# EAGLE design mini_board0 (EAGLE 6.4)
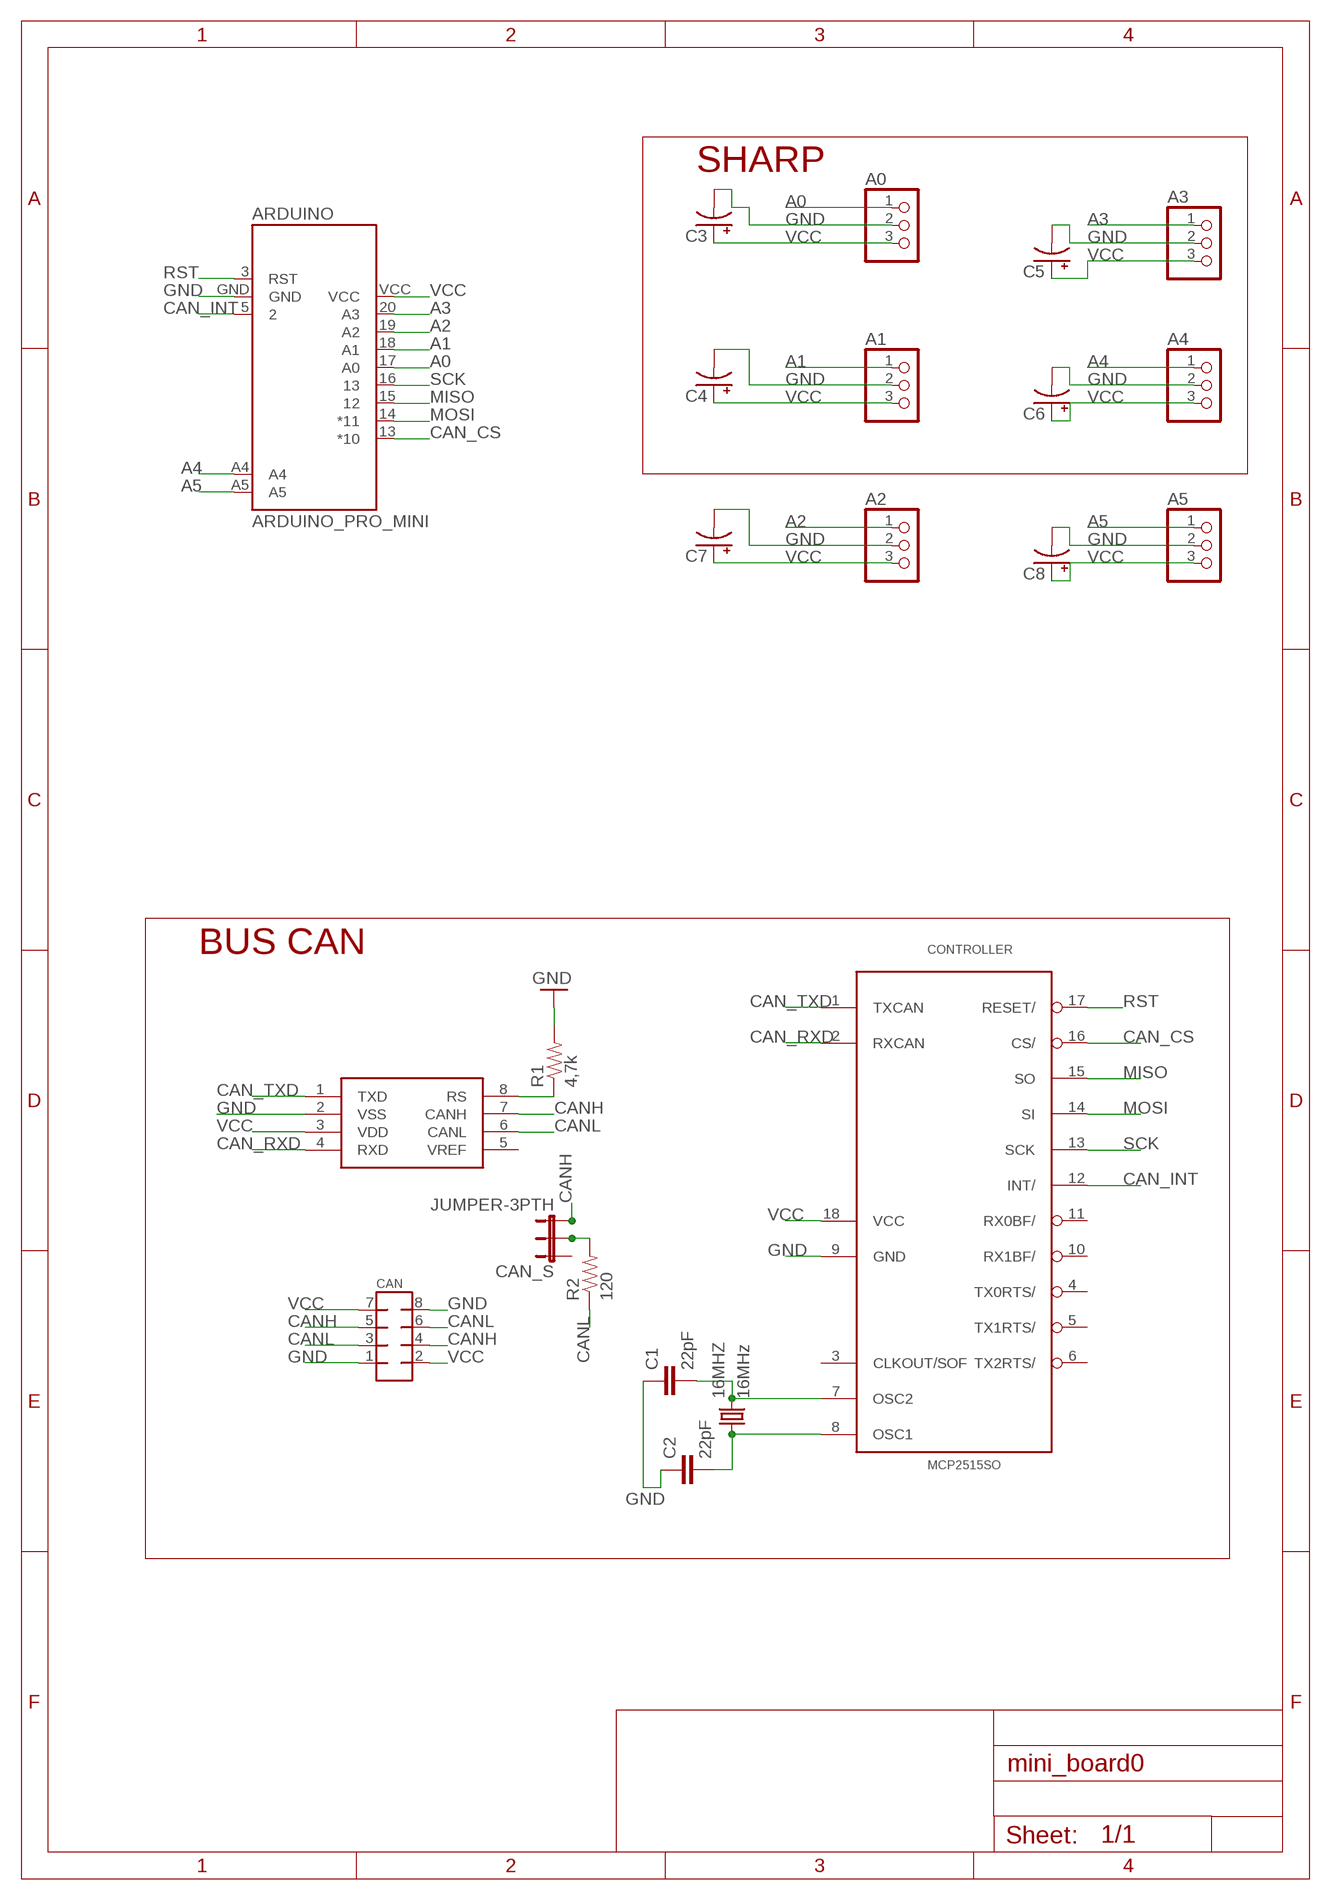
[diagram p0: schematic, sheet 1]

## Parts
16MHZ  16MHz  CRYSTALHC49S  [HC49/S]
A0  PINHD-1X3/90  [1X03/90]
A1  PINHD-1X3/90  [1X03/90]
A2  PINHD-1X3/90  [1X03/90]
A3  PINHD-1X3/90  [1X03/90]
A4  PINHD-1X3/90  [1X03/90]
A5  PINHD-1X3/90  [1X03/90]
ARDUINO  ARDUINO_PRO_MINI  [ARDUINO_PRO_MINI]
C1  22pF  CAP0805  [0805]
C2  22pF  CAP0805  [0805]
C3  CAP_POLPTH2  [CPOL-RADIAL-10UF-25V]
C4  CAP_POLPTH2  [CPOL-RADIAL-10UF-25V]
C5  CAP_POLPTH2  [CPOL-RADIAL-10UF-25V]
C6  CAP_POLPTH2  [CPOL-RADIAL-10UF-25V]
C7  CAP_POLPTH2  [CPOL-RADIAL-10UF-25V]
C8  CAP_POLPTH2  [CPOL-RADIAL-10UF-25V]
CAN  MMATCH-8-PTH  [AMP-215079-8]
CAN_S  JUMPER-3PTH  [1X03]
CONTROLLER  MCP2515SO  [SO18L]
R1  4,7k  RESISTOR0805-RES  [0805]
R2  120  RESISTOR0805-RES  [0805]
U1  MCP2551  [SO08]

## Nets
A0: A0.1 ARDUINO.17(A0)
A1: A1.1 ARDUINO.18(A1)
A2: A2.1 ARDUINO.19(A2)
A3: A3.1 ARDUINO.20(A3)
A4: A4.1 ARDUINO.A4
A5: A5.1 ARDUINO.A5
CAN_CS: ARDUINO.13(*10) CONTROLLER.16(CS/)
CAN_INT: ARDUINO.5 CONTROLLER.12(INT/)
CAN_RXD: CONTROLLER.2(RXCAN) U1.4(RXD)
CAN_TXD: CONTROLLER.1(TXCAN) U1.1(TXD)
CANH: CAN.4 CAN.5 CAN_S.3 U1.7(CANH)
CANL: CAN.3 CAN.6 R2.1 U1.6(CANL)
GND: A0.2 A1.2 A2.2 A3.2 A4.2 A5.2 ARDUINO.GND C1.1 C2.1 C3.2(-) C4.2(-) C5.2(-) C6.2(-) C7.2(-) C8.2(-) CAN.1 CAN.8 CONTROLLER.9(GND) R1.2 U1.2(VSS)
MISO: ARDUINO.15 CONTROLLER.15(SO)
MOSI: ARDUINO.14(*11) CONTROLLER.14(SI)
N$2: 16MHZ.2 C1.2 CONTROLLER.7(OSC2)
N$3: 16MHZ.1 C2.2 CONTROLLER.8(OSC1)
N$5: R1.1 U1.8(RS)
N$7: CAN_S.2 R2.2
RST: ARDUINO.3(RST) CONTROLLER.17(RESET/)
SCK: ARDUINO.16 CONTROLLER.13(SCK)
VCC: A0.3 A1.3 A2.3 A3.3 A4.3 A5.3 ARDUINO.VCC C3.1(+) C4.1(+) C5.1(+) C6.1(+) C7.1(+) C8.1(+) CAN.2 CAN.7 CONTROLLER.18(VCC) U1.3(VDD)
Unconnected: CAN_S.1 CONTROLLER.3(CLKOUT/SOF) CONTROLLER.4(TX0RTS/) CONTROLLER.5(TX1RTS/) CONTROLLER.6(TX2RTS/) CONTROLLER.10(RX1BF/) CONTROLLER.11(RX0BF/) U1.5(VREF)

## Notes on the sheet
- SHARP
- BUS CAN

## Library data of the parts
16MHZ = adafruit:CRYSTAL: CRYSTAL; OC_FARNELL: 1667008; OC_NEWARK: unknown
A0 A1-A5 = pinhead:PINHD-1X3: PIN HEADER
ARDUINO = sharp_shield:ARDUINO_PRO_MINI
C1 C2 = SparkFun-Capacitors:CAP: Capacitor Standard 0603 ceramic capacitor, and 0.1" leaded capacitor.
C3-C8 = SparkFun-Capacitors:CAP_POL: Capacitor Polarized These are standard SMD and PTH capacitors. Normally 10uF, 47uF, and 100uF in electrolytic and tantalum varieties. Always verify the external diameter of the through hole cap, it varies with capacity, voltage, and manufacturer. The EIA devices should be standard.
CAN = jt-con-micromatch:MMATCH-8-*: AMP Micromatch 8-pin
CAN_S = SparkFun-Passives:JUMPER-3
CONTROLLER = MCP2515_MT:MCP2515*: MCP2515 Standalone CAN-Controller by Microchip Eagle-Lib. by MartinThomas
R1 R2 = SparkFun-Passives:RESISTOR: Resistor Basic schematic elements and footprints for 0603, 1206, and PTH resistors.
U1 = SparkFun-DigitalIC:MCP2551: CAN transceiver

## Net classes
0 default: clearance 0.205 mm

## Board
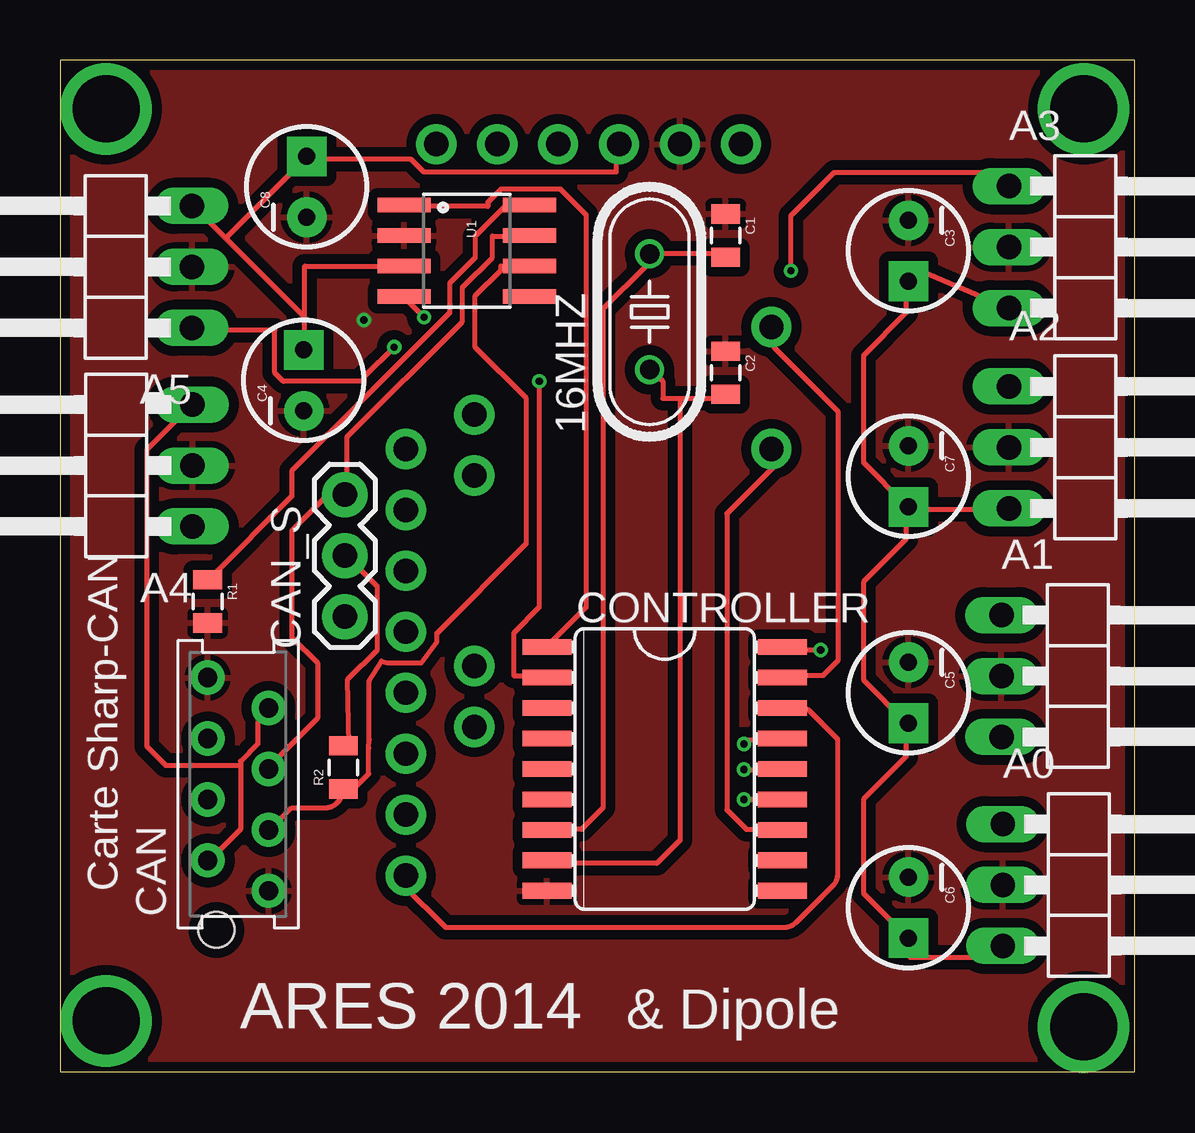
[diagram p1: board, top side]
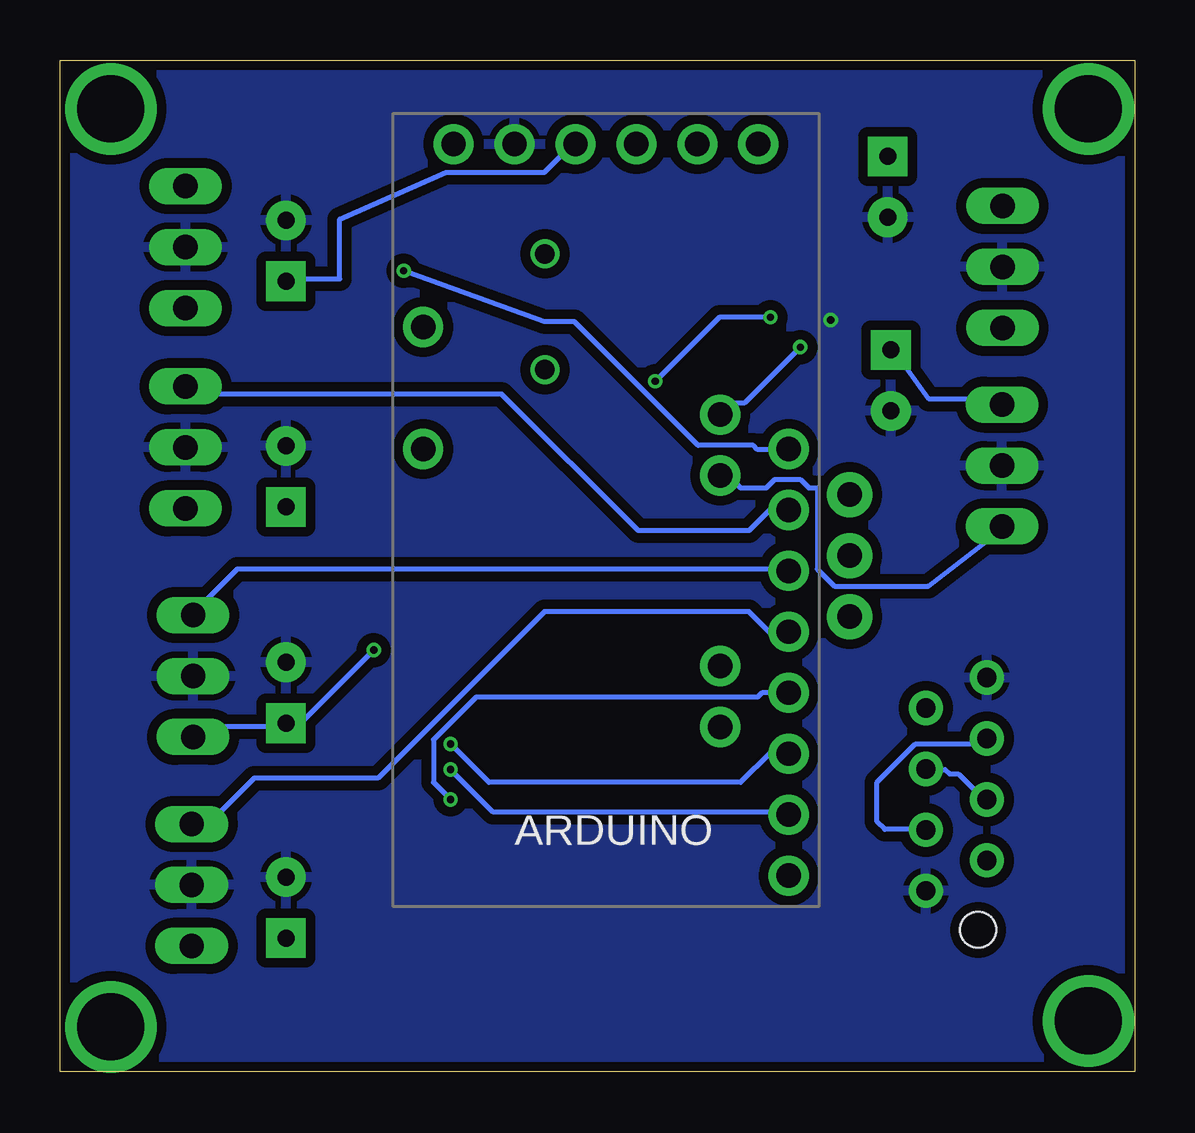
[diagram p2: board, bottom side, seen from below]

Size 44.79 x 42.15 mm. Coordinates in mm from the lower left corner, seen from the top.
Outline: 0,42.15 0,0 44.79,0 44.79,42.15 0,42.15
Copper layers (1*16): Top 0.035mm / dielectric 1.6mm / Bottom 0.035mm
Design rules "dipole *": minimum track width 0.2mm, minimum drill 0.3mm, track to track 0.15mm, track to pad 0.15mm, pad to pad 0.15mm, via to via 0.15mm, smd to smd 0.01mm, copper to edge 0.01mm, drill to drill 0.01mm, minimum pad ring 0.15mm, minimum via ring 0.15mm, stop-mask expansion 1mil, vias tented up to drill 0mil, thermal gap 10mil

### Footprints (pad centres in the part's own frame; a part is rotated, then mirrored left to right if it is on the bottom)
HC49/S = drill 0.813: 1 -2.413,0; 2 2.413,0
1X03/90 = drill 1.016 long: 1 -2.54,-3.81; 2 0,-3.81; 3 2.54,-3.81
ARDUINO_PRO_MINI = drill 1.016 pad 1.676: 3 -7.62,7.62; 5 -7.62,2.54; 13 7.62,-15.24; 14 7.62,-12.7; 15 7.62,-10.16; 16 7.62,-7.62; 17 7.62,-5.08; 18 7.62,-2.54; 19 7.62,0; 20 7.62,2.54; A4 4.763,1.429; A5 4.763,3.969; A6 4.763,-9.049; A7 4.763,-6.509; BLK -6.35,15.24; GND -3.81,15.24; GRN 6.35,15.24; RXI 1.27,15.24; TXO 3.81,15.24; VCC -1.27,15.24
0805 = smd 0.8 x 1.2: 1 -0.9,0; 2 0.9,0
CPOL-RADIAL-10UF-25V = drill 0.7 pad 1.651 square: 1 1.27,0 | drill 0.7 pad 1.651: 2 -1.27,0
AMP-215079-8 = drill 0.8 pad 1.422: 1 0,-1.27; 2 1.27,1.27; 3 2.54,-1.27; 4 3.81,1.27; 5 5.08,-1.27; 6 6.35,1.27; 7 7.62,-1.27; 8 8.89,1.27 | hole 1.5: -1.62,0.905
1X03 = drill 1.016 pad 1.88: 1 0,0; 2 2.54,0; 3 5.08,0
SO18L = smd 0.66 x 2.032: 1 -5.08,-4.902; 2 -3.81,-4.902; 3 -2.54,-4.902; 4 -1.27,-4.902; 5 0,-4.902; 6 1.27,-4.902; 7 2.54,-4.902; 8 3.81,-4.902; 9 5.08,-4.902; 10 5.08,4.902; 11 3.81,4.902; 12 2.54,4.902; 13 1.27,4.902; 14 0,4.902; 15 -1.27,4.902; 16 -2.54,4.902; 17 -3.81,4.902; 18 -5.08,4.902
SO08 = smd 0.61 x 2.21: 1 -1.905,-2.616; 2 -0.635,-2.616; 3 0.635,-2.616; 4 1.905,-2.616; 5 1.905,2.616; 6 0.635,2.616; 7 -0.635,2.616; 8 -1.905,2.616

### Placement (x,y rotation side)
16MHZ  24.57,31.66 90 top
A0  43.11,7.78 270 top
A1  43.05,16.49 270 top
A2  43.37,26.01 270 top
A3  43.37,34.36 270 top
A4  1.71,25.26 90 top
A5  1.69,33.53 90 top
ARDUINO  22.03,23.41 0 bottom
C1  27.75,34.84 270 top
C2  27.75,29.12 270 top
C3  35.37,34.2 270 top
C4  10.16,28.8 90 top
C5  35.37,15.79 270 top
C6  35.37,6.83 270 top
C7  35.37,24.8 270 top
C8  10.29,36.87 90 top
CAN  7.43,7.53 90 top
CAN_S  11.87,18.96 90 top
CONTROLLER  25.21,12.61 270 top
R1  6.16,19.6 270 top
R2  11.81,12.68 90 top
U1  16.95,34.2 270 top

### Tracks (layer width: path | path; a pad name or v marks a point on that pad's centre or on a via)
A0
  Bottom 0.2: A0.1 39,9.92 36.69,12.23 31.53,12.23 24.6,19.16 16.07,19.16 15.18,18.28 14.47,18.28 ARDUINO.17
A1
  Bottom 0.2: A1.1 39.18,19.16 37.4,20.94 14.47,20.94 ARDUINO.18
A2
  Bottom 0.2: A2.1 39.54,28.41 39.36,28.23 26.38,28.23 20.69,22.54 16.07,22.54 15.18,23.43 14.47,23.43 ARDUINO.19
A3  (via drill 0.3)
  Top 0.2: v30.47,33.37 30.47,35.66 32.28,37.47 39.18,37.47 A3.1
  Bottom 0.2: v30.47,33.37 24.6,31.26 23.36,31.26 18.2,26.1 15.89,26.1 15.71,25.92 14.47,25.92 ARDUINO.20
A4
  Bottom 0.2: A4.1 5.31,22.76 8.6,20.23 12.51,20.23 13.22,20.94 13.22,24.32 13.58,24.32 13.93,24.68 15,24.68 15.35,24.32 16.42,24.32 16.95,24.85 17.13,24.85 ARDUINO.A4
A5  (via drill 0.3)
  Top 0.2: v13.93,30.19 12.69,28.94 12.69,28.77 9.31,28.77 8.95,29.12 8.95,30.9 5.58,30.9 A5.1
  Bottom 0.2: v13.93,30.19 16.24,27.88 16.78,27.88 17.13,27.52 ARDUINO.A5
CAN_CS
  Top 0.2: CONTROLLER.16 30.11,15.08 31.2,15.08 32.42,13.85 32.42,8.23 arc-45 32.23,7.77 30.67,6.21 arc-45 30.18,6.01 16.07,6.01 14.29,7.79 14.29,8.14 ARDUINO.13
CAN_INT
  Top 0.2: CONTROLLER.12 30.11,10.1 28.61,10.1 27.8,10.91 27.8,23.25 29.76,25.21 29.76,25.92 ARDUINO.5
CAN_RXD  (via drill 0.3)
  Top 0.2: v19.98,28.77 19.98,19.34 18.91,18.28 18.91,16.5 20.15,16.5 CONTROLLER.2 | v15.18,31.43 14.47,32.14 U1.4
  Bottom 0.2: v19.98,28.77 17.31,31.43 v15.18,31.43
CAN_TXD
  Top 0.2: 15.35,36.06 14.47,36.06 U1.1 15.35,36.06 | CONTROLLER.1 20.33,17.74 21.93,19.34 21.93,35.7 20.87,36.77 18.38,36.77 17.84,36.23 17.84,36.06 15.35,36.06
CANH
  Top 0.2: 11.98,24.85 11.98,24.14 CAN_S.3 11.98,24.85 | 11.98,24.85 11.98,26.45 16.78,31.26 16.78,32.68 18.02,33.92 18.02,34.81 19.44,34.81 U1.7 | 11.98,24.85 9.66,22.54 9.66,18.1 10.73,17.03 10.73,14.72 8.78,12.76 CAN.5
  Bottom 0.2: CAN.4 6.29,11.34 7.35,12.41 7.71,12.41 7.89,12.59 8.6,12.59 CAN.5
CANL
  Top 0.2: CAN.3 8.78,10.1 9.66,10.99 11.01,10.99 arc89 R2.1 11.91,11.67 11.98,11.52 12.87,12.41 12.87,13.48 12.89,13.83 12.89,16.28 13.4,17.1 13.65,17.03 15.07,17.03 15.71,17.92 15.71,18.28 19.44,22.01 19.44,28.05 17.31,30.19 17.31,32.32 18.38,33.39 18.38,33.57 U1.6
  Bottom 0.2: CAN.6 6.29,13.83 6.46,13.65 9.13,13.65 10.73,12.05 10.73,10.42 10.41,10.1 8.78,10.1 CAN.3
GND  (via drill 0.3)
  other vias: 12.67,31.32
  pour Top (isolate 0.406): -3.21,42.42 49.98,43.55 47.66,0.45 -5.33,-1.05
  pour Bottom (isolate 0.406): -3.48,43.42 -4.85,-1.8 47.85,-0.55 50.16,41.92
MISO  (via drill 0.3)
  Top 0.2: v28.51,13.65 28.51,13.83 30.11,13.83 CONTROLLER.15
  Bottom 0.2: v28.51,13.65 26.91,12.05 16.42,12.05 15.18,13.3 14.47,13.3 ARDUINO.15
MOSI  (via drill 0.3)
  Top 0.2: v28.51,12.59 30.11,12.59 CONTROLLER.14
  Bottom 0.2: v28.51,12.59 26.73,10.81 14.47,10.81 ARDUINO.14
N$1  (via drill 2.8)
  other vias: 1.92,2.12
N$2
  Top 0.2: C1.2 27.62,34.1 24.6,34.1 16MHZ.2 24.42,33.92 24.42,33.57 22.64,31.79 22.64,11 21.74,10.1 20.33,10.1 CONTROLLER.7
N$3
  Top 0.2: 25.84,28.05 25.13,28.05 25.13,28.77 24.6,29.3 16MHZ.1 | 25.84,28.05 27.62,28.05 C2.2 | 25.84,28.05 25.84,9.64 24.88,8.67 20.33,8.67 CONTROLLER.8
N$4  (via drill 2.8)
  other vias: 42.67,1.87
N$5
  Top 0.2: R1.1 6.29,20.59 9.66,23.97 9.66,25.03 16.24,31.61 16.24,32.86 17.31,33.92 17.31,34.81 18.55,36.06 19.44,36.06 U1.8
N$6  (via drill 2.8)
  other vias: 42.67,40.12
N$7
  Top 0.2: R2.2 12.04,13.58 11.98,16.32 13.22,17.56 13.22,20.23 11.98,21.48 CAN_S.2 11.98,21.65
N$9  (via drill 2.8)
  other vias: 1.92,40.12
RST
  Top 0.2: CONTROLLER.17 30.11,16.5 31.8,16.5 32.42,17.12 32.42,27.52 29.76,30.19 29.76,30.9 ARDUINO.3
SCK  (via drill 0.3)
  Top 0.2: v28.51,11.34 CONTROLLER.13
  Bottom 0.2: v28.51,11.34 29.22,12.05 29.22,13.83 27.44,15.61 15.71,15.61 15.53,15.79 ARDUINO.16
VCC  (via drill 0.3)
  Top 0.2: 7.53,12.76 7.53,12.94 8.24,13.65 8.24,14.54 8.6,14.9 8.6,15.08 CAN.7 | 7.53,12.76 7.53,10.1 6.29,8.85 CAN.2 | A0.3 39,4.76 35.45,4.76 35.45,5.47 C6.1 35.27,5.65 33.49,7.43 33.49,11.34 35.27,13.12 35.27,14.36 C5.1 35.27,14.54 33.49,16.32 33.49,20.41 35.27,22.19 35.27,23.43 C7.1 | 30.11,17.74 CONTROLLER.18 30.11,17.56 v31.71,17.56 | A2.3 39.54,23.43 35.45,23.43 C7.1 | A3.3 35.45,33.57 35.45,33.03 C3.1 35.27,32.86 35.27,31.61 33.49,29.83 33.49,25.39 35.27,23.61 C7.1 | 7.53,12.76 4.41,12.76 3.62,13.55 3.62,25.92 5.4,27.7 A4.3 | U1.3 10.2,33.57 10.2,31.43 | 10.2,31.43 10.2,30.19 C4.1 | 10.2,31.43 7,34.63 | 7,34.63 5.58,36.06 A5.3 | 7,34.63 7,34.81 10.2,38.01 C8.1 10.38,38.01 14.64,38.01 15.18,37.48 23.18,37.48 23.18,38.54 ARDUINO.VCC
  Bottom 0.2: v31.71,17.56 34.73,14.54 35.27,14.54 C5.1 35.45,14.36 38.82,14.36 A1.3 | ARDUINO.VCC 23.36,38.72 24.6,37.47 28.69,37.47 33.13,35.52 33.13,33.03 35.27,33.03 C3.1 | C4.1 10.02,30.01 8.57,28.02 5.54,28.02 A4.3

### Text on the board
tNames: Carte Sharp-CAN | ARES 2014 | & Dipole
200bmp: /home/showok/Documents/Projets/Ares/Robot-2013-2014/cartes/logo_ares_3.bmp